# Altium schematic sheet Sheet1.SchDoc
size A; SheetNumber: 1; SheetTotal: 1
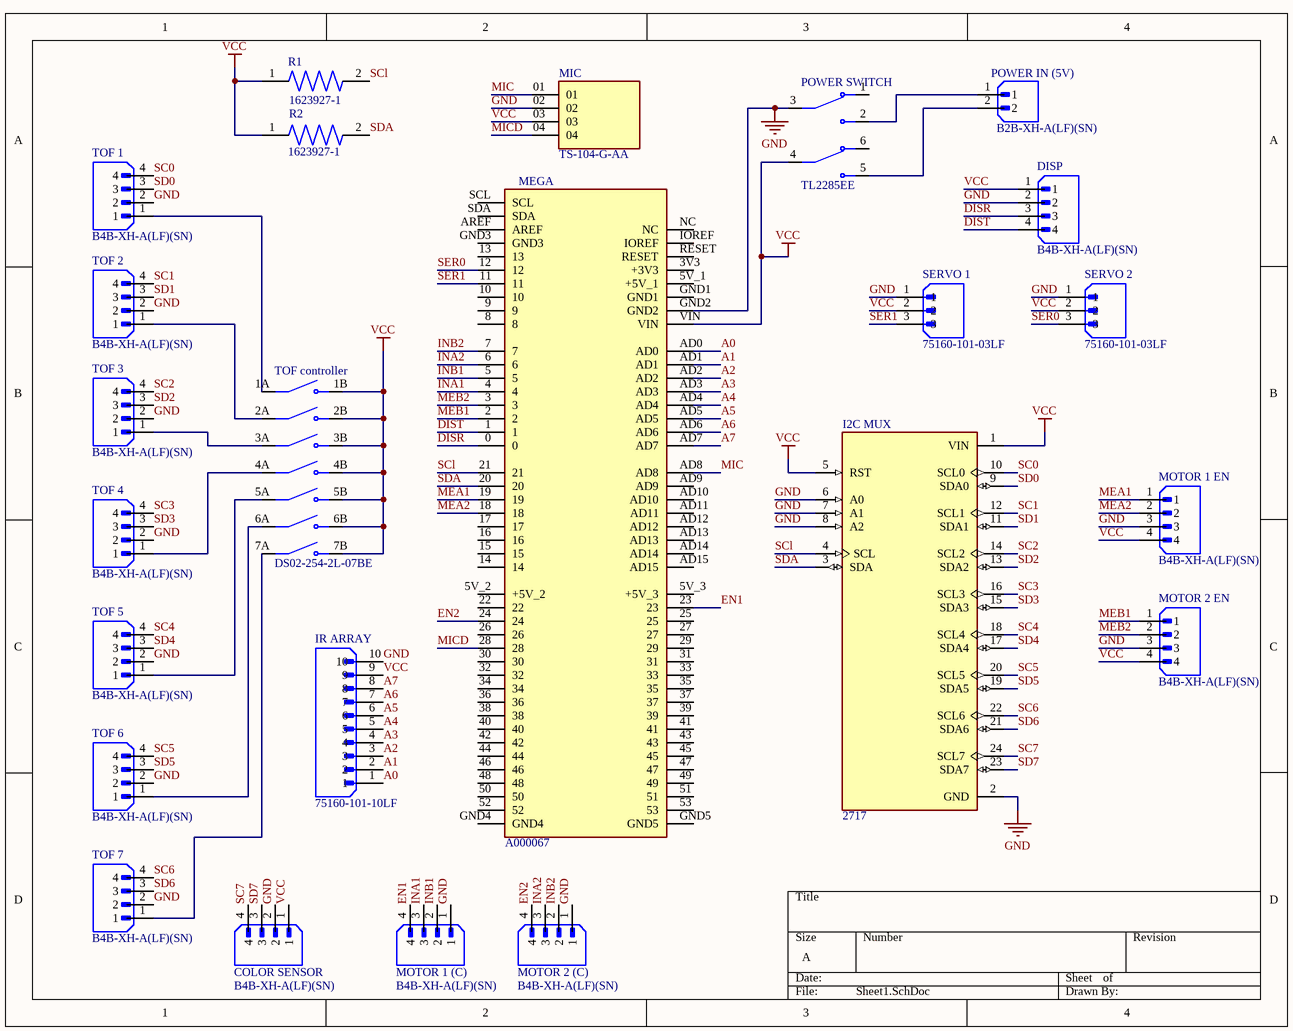
[diagram p0: Sheet1.SchDoc]

## Parts
COLOR_SENSOR  B4B-XH-A(LF)(SN)  [JST_B4B-XH-A(LF)(SN)]
DISP  B4B-XH-A(LF)(SN)  [JST_B4B-XH-A(LF)(SN)]
I2C_MUX  2717  [MODULE_2717]
IR_ARRAY  75160-101-10LF  [AMPHENOL_75160-101-10LF]
MEGA  A000067  [ARDUINO_A000067]
MIC  TS-104-G-AA  [SAMTEC_TS-104-G-AA]
MOTOR_1_(C)  B4B-XH-A(LF)(SN)  [JST_B4B-XH-A(LF)(SN)]
MOTOR_1_EN  B4B-XH-A(LF)(SN)  [JST_B4B-XH-A(LF)(SN)]
MOTOR_2_(C)  B4B-XH-A(LF)(SN)  [JST_B4B-XH-A(LF)(SN)]
MOTOR_2_EN  B4B-XH-A(LF)(SN)  [JST_B4B-XH-A(LF)(SN)]
POWER_IN_(5V)  B2B-XH-A(LF)(SN)  [JST_B2B-XH-A(LF)(SN)]
POWER_SWITCH  TL2285EE  [SW_TL2285EE]
R1  1623927-1  [RESAD700W45L350D185]
R2  1623927-1  [RESAD700W45L350D185]
SERVO_1  75160-101-03LF  [AMPHENOL_75160-101-03LF]
SERVO_2  75160-101-03LF  [AMPHENOL_75160-101-03LF]
TOF_1  B4B-XH-A(LF)(SN)  [JST_B4B-XH-A(LF)(SN)]
TOF_2  B4B-XH-A(LF)(SN)  [JST_B4B-XH-A(LF)(SN)]
TOF_3  B4B-XH-A(LF)(SN)  [JST_B4B-XH-A(LF)(SN)]
TOF_4  B4B-XH-A(LF)(SN)  [JST_B4B-XH-A(LF)(SN)]
TOF_5  B4B-XH-A(LF)(SN)  [JST_B4B-XH-A(LF)(SN)]
TOF_6  B4B-XH-A(LF)(SN)  [JST_B4B-XH-A(LF)(SN)]
TOF_7  B4B-XH-A(LF)(SN)  [JST_B4B-XH-A(LF)(SN)]
TOF_controller  DS02-254-2L-07BE  [SW_DS02-254-2L-07BE]

## Nets
GND: COLOR_SENSOR.2 DISP.2 I2C_MUX.2(GND) I2C_MUX.6(A0) I2C_MUX.7(A1) I2C_MUX.8(A2) IR_ARRAY.10 MEGA.GND2 MIC.02 MOTOR_1_(C).1 MOTOR_1_EN.3 MOTOR_2_(C).1 MOTOR_2_EN.3 POWER_SWITCH.3(COM1) SERVO_1.1 SERVO_2.1 TOF_1.2 TOF_2.2 TOF_3.2 TOF_4.2 TOF_5.2 TOF_6.2 TOF_7.2
VCC: COLOR_SENSOR.1 DISP.1 I2C_MUX.1(VIN) I2C_MUX.5(RST) IR_ARRAY.9 MEGA.VIN MIC.03 MOTOR_1_EN.4 MOTOR_2_EN.4 POWER_SWITCH.4(COM2) R1.1 R2.1 SERVO_1.2 SERVO_2.2 TOF_controller.1B(NO1) TOF_controller.2B(NO2) TOF_controller.3B(NO3) TOF_controller.4B(NO4) TOF_controller.5B(NO5) TOF_controller.6B(NO6) TOF_controller.7B(NO7)
A0: IR_ARRAY.1 MEGA.AD0
A1: IR_ARRAY.2 MEGA.AD1
A2: IR_ARRAY.3 MEGA.AD2
A3: IR_ARRAY.4 MEGA.AD3
A4: IR_ARRAY.5 MEGA.AD4
A5: IR_ARRAY.6 MEGA.AD5
A6: IR_ARRAY.7 MEGA.AD6
A7: IR_ARRAY.8 MEGA.AD7
DISR: DISP.3 MEGA.0
DIST: DISP.4 MEGA.1
EN1: MEGA.23 MOTOR_1_(C).4
EN2: MEGA.24 MOTOR_2_(C).4
INA1: MEGA.4 MOTOR_1_(C).3
INA2: MEGA.6 MOTOR_2_(C).3
INB1: MEGA.5 MOTOR_1_(C).2
INB2: MEGA.7 MOTOR_2_(C).2
MEA1: MEGA.19 MOTOR_1_EN.1
MEA2: MEGA.18 MOTOR_1_EN.2
MEB1: MEGA.2 MOTOR_2_EN.1
MEB2: MEGA.3 MOTOR_2_EN.2
MIC: MEGA.AD8 MIC.01
MICD: MEGA.28 MIC.04
SC0: I2C_MUX.10(SCL0) TOF_1.4
SC1: I2C_MUX.12(SCL1) TOF_2.4
SC2: I2C_MUX.14(SCL2) TOF_3.4
SC3: I2C_MUX.16(SCL3) TOF_4.4
SC4: I2C_MUX.18(SCL4) TOF_5.4
SC5: I2C_MUX.20(SCL5) TOF_6.4
SC6: I2C_MUX.22(SCL6) TOF_7.4
SC7: COLOR_SENSOR.4 I2C_MUX.24(SCL7)
SCl: I2C_MUX.4(SCL) MEGA.21 R1.2
SD0: I2C_MUX.9(SDA0) TOF_1.3
SD1: I2C_MUX.11(SDA1) TOF_2.3
SD2: I2C_MUX.13(SDA2) TOF_3.3
SD3: I2C_MUX.15(SDA3) TOF_4.3
SD4: I2C_MUX.17(SDA4) TOF_5.3
SD5: I2C_MUX.19(SDA5) TOF_6.3
SD6: I2C_MUX.21(SDA6) TOF_7.3
SD7: COLOR_SENSOR.3 I2C_MUX.23(SDA7)
SDA: I2C_MUX.3(SDA) MEGA.20 R2.2
SER0: MEGA.12 SERVO_2.3
SER1: MEGA.11 SERVO_1.3
NetPOWER_IN_(5V)_1: POWER_IN_(5V).1 POWER_SWITCH.2(NO1)
NetPOWER_IN_(5V)_2: POWER_IN_(5V).2 POWER_SWITCH.5(NO2)
NetTOF_1_1: TOF_1.1 TOF_controller.1A(COM1)
NetTOF_2_1: TOF_2.1 TOF_controller.2A(COM2)
NetTOF_3_1: TOF_3.1 TOF_controller.3A(COM3)
NetTOF_4_1: TOF_4.1 TOF_controller.4A(COM4)
NetTOF_5_1: TOF_5.1 TOF_controller.5A(COM5)
NetTOF_6_1: TOF_6.1 TOF_controller.6A(COM6)
NetTOF_7_1: TOF_7.1 TOF_controller.7A(COM7)

Not connected (* = marked no-connect by the designer): MEGA 3V3(+3V3) 5V_1(+5V_1) 5V_2(+5V_2) 5V_3(+5V_3) 8 9 10 13 14 15 16 17 22 25 26 27 29 30 31 32 33 34 35 36 37 38 39 40 41 42 43 44 45 46 47 48 49 50 51 52 53 AD9 AD10 AD11 AD12 AD13 AD14 AD15 AREF GND1 GND3 GND4 GND5 IOREF NC RESET SCL SDA; POWER_SWITCH 1(NC1) 6(NC2)

## Library data of the parts
COLOR_SENSOR DISP MOTOR_1_(C) MOTOR_1_EN MOTOR_2_(C) MOTOR_2_EN TOF_1-TOF_7 = B4B-XH-A(LF)(SN): Connector Header Through Hole 4 position 0.098 (2.50mm); MF: JST Sales; SnapEDA_Link: https://www.snapeda.com/parts/B4B-XH-A(LF)(SN)/JST+Sales+America+Inc./view-part/?ref=snap; Package: None; Value: *; MP: B4B-XH-A(LF)(SN); Check_prices: https://www.snapeda.com/parts/B4B-XH-A(LF)(SN)/JST+Sales+America+Inc./view-part/?ref=eda
I2C_MUX = 2717: Module: multiplexer; I2C interface multiplexer; TCA9548A; 3Ã·5VDC; MF: Adafruit; SnapEDA_Link: https://www.snapeda.com/parts/2717/Adafruit+Industries+LLC/view-part/?ref=snap; Availability: In Stock; Purchase-URL: https://pricing.snapeda.com/search/part/2717/?ref=eda; Check_prices: https://www.snapeda.com/parts/2717/Adafruit+Industries+LLC/view-part/?ref=eda; Value: *; Package: None; MP: 2717; Price: None
MEGA = A000067: Arduino Mega 2560 Rev3. ATmega2560 Microcontroller Mega Development Board 16MHz CPU 8KB RAM 4KB/256KB EEPROM/Flash; MF: Arduino; Package: Non-Standard Arduino; Price: None; Check_prices: https://www.snapeda.com/parts/A000067/Arduino/view-part/?ref=eda; Value: *; SnapEDA_Link: https://www.snapeda.com/parts/A000067/Arduino/view-part/?ref=snap; MP: A000067; Availability: In Stock; Purchase-URL: https://pricing.snapeda.com/search?q=A000067&ref=eda
MIC = TS-104-G-AA: MF: Samtec Inc.; Price: None; Package: None; Availability: Unavailable; Value: *; MP: TS-104-G-AA
POWER_IN_(5V) = B2B-XH-A(LF)(SN): Connector Header Through Hole 2 position 0.098 (2.50mm); MF: JST Sales America Inc.; SnapEDA_Link: https://www.snapeda.com/parts/B2B-XH-A(LF)(SN)/JST+Sales+America+Inc./view-part/?ref=snap; Package: None; Value: *; MP: B2B-XH-A(LF)(SN); Check_prices: https://www.snapeda.com/parts/B2B-XH-A(LF)(SN)/JST+Sales+America+Inc./view-part/?ref=eda
R1 R2 = 1623927-1: Res Carbon Film 100K Ohm 5% 0.25W(1/4W) -700ppm/Â°C to 0ppm/Â°C Conformal Coated AXL Ammo Pack; MF: TE Connectivity; Availability: In Stock; EU_RoHS_Compliance: Compliant; SnapEDA_Link: https://www.snapeda.com/parts/1623927-1/TE+Connectivity/view-part/?ref=snap; Price: None; Check_prices: https://www.snapeda.com/parts/1623927-1/TE+Connectivity/view-part/?ref=eda; Package: None; MP: 1623927-1; Value: *
SERVO_1 SERVO_2 = 75160-101-03LF: BergStikÂ®, Board to Board connector, Unshrouded vertical header, through hole, single Row,3 position, 2.54mm pitch; MF: Amphenol ICC (FCI); SnapEDA_Link: https://www.snapeda.com/parts/75160-101-03LF/Amphenol+FCI/view-part/?ref=snap; Availability: In Stock; Purchase-URL: https://pricing.snapeda.com/search/part/75160-101-03LF/?ref=eda; Check_prices: https://www.snapeda.com/parts/75160-101-03LF/Amphenol+FCI/view-part/?ref=eda; Value: *; Package: None; MP: 75160-101-03LF; Price: None
IR_ARRAY = 75160-101-10LF: Price: None; MP: 75160-101-10LF; Package: None; Value: *; Availability: Unavailable
POWER_SWITCH = TL2285EE: Value: *; Package: None; Price: None; MP: TL2285EE; Availability: Unavailable
TOF_controller = DS02-254-2L-07BE: Availability: Unavailable; Price: None; Package: None; Value: *; MP: DS02-254-2L-07BE